# EAGLE design power supply (EAGLE 9.6.2)
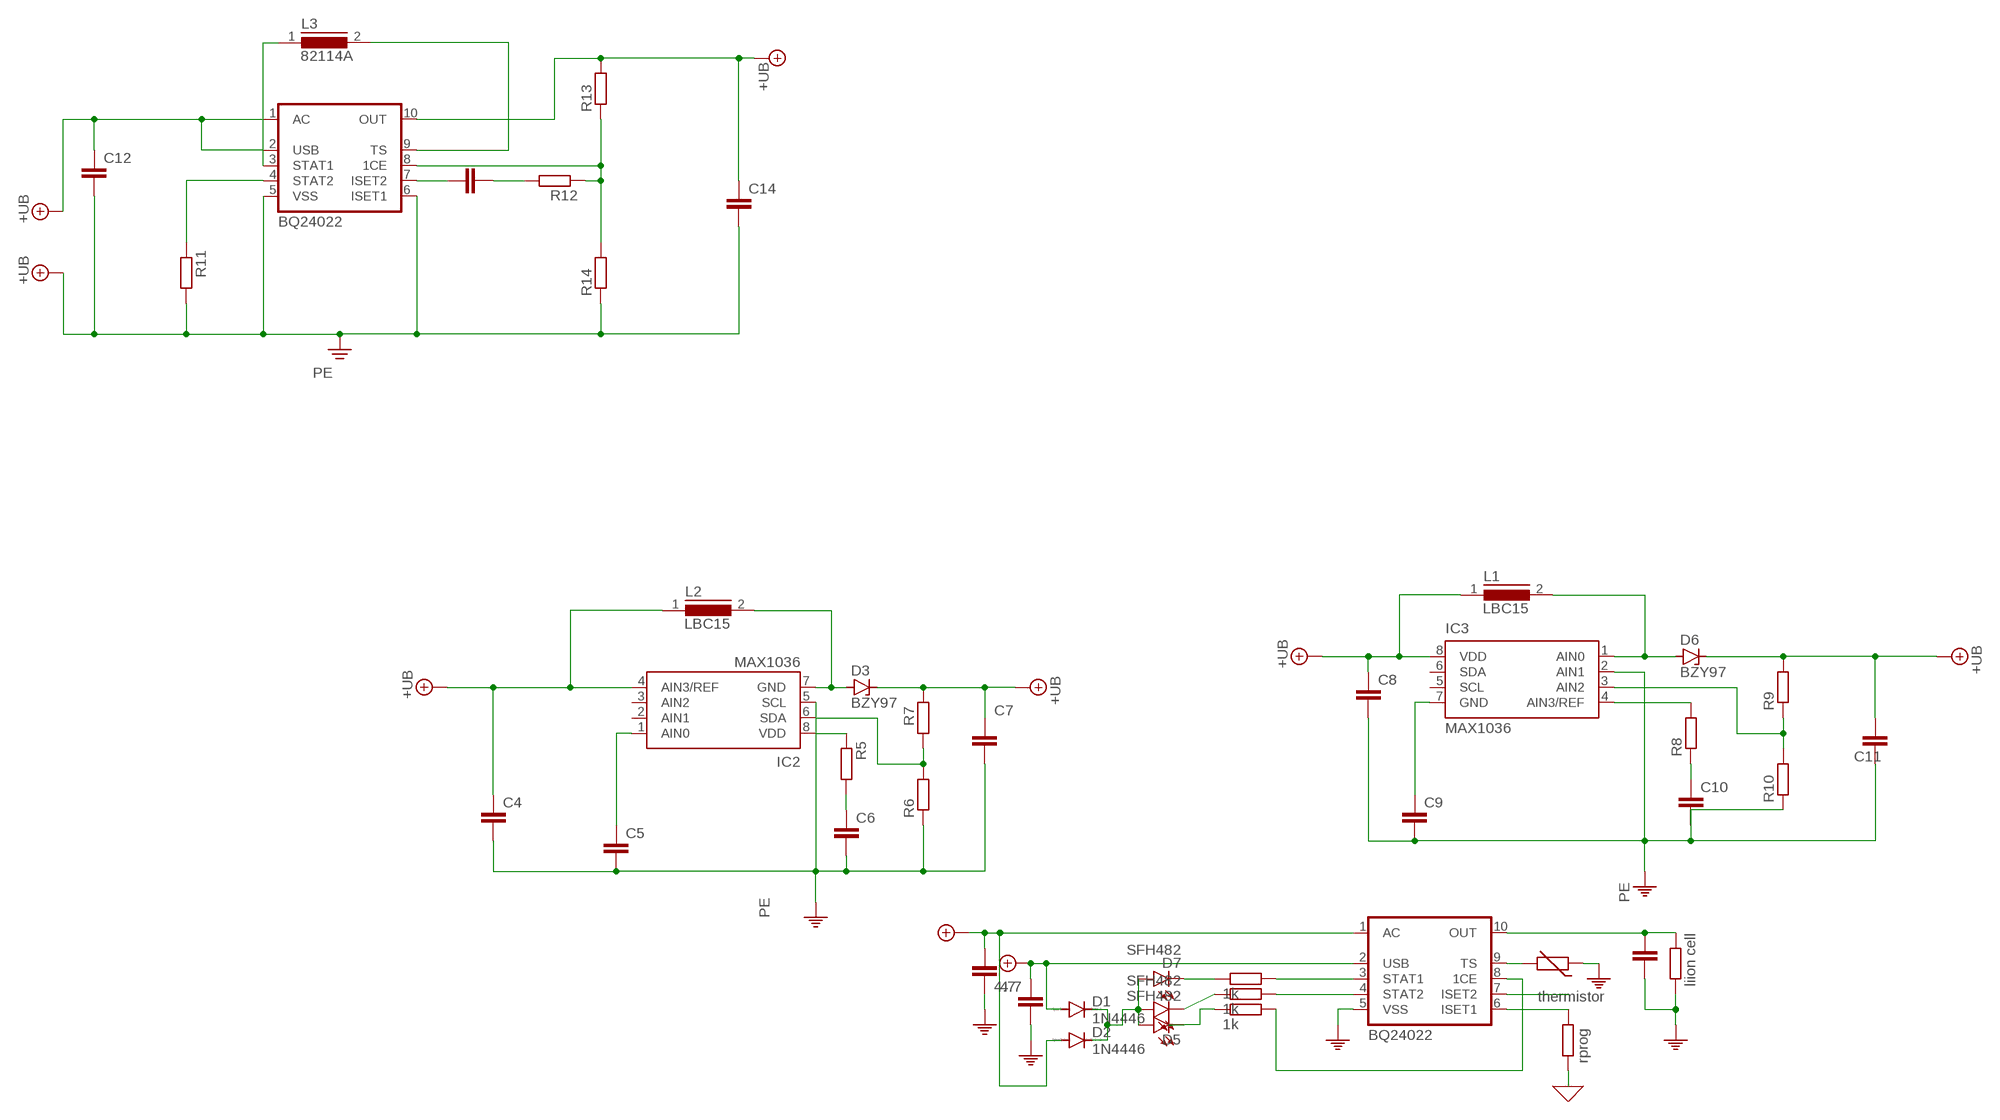
[diagram p0: schematic, sheet 1]

## Parts
C1  4.7  C2,5-3  [C2.5-3]
C2  4.7  C2,5-3  [C2.5-3]
C3  C2,5-3  [C2.5-3]
C4  C2,5-3  [C2.5-3]
C5  C2,5-3  [C2.5-3]
C6  C2,5-3  [C2.5-3]
C7  C2,5-3  [C2.5-3]
C8  C2,5-3  [C2.5-3]
C9  C2,5-3  [C2.5-3]
C10  C2,5-3  [C2.5-3]
C11  C2,5-3  [C2.5-3]
C12  C2,5-3  [C2.5-3]
C13  C2,5-3  [C2.5-3]
C14  C2,5-3  [C2.5-3]
D1  1N4446  [DO35-10]
D2  1N4446  [DO35-10]
D3  BZY97  [F126Z12]
D4  SFH482  [SFH482]
D5  SFH482  [SFH482]
D6  BZY97  [F126Z12]
D7  SFH482  [SFH482]
IC1  BQ24022  [DRC-S-PVSON-N10]
IC2  MAX1036  [SOT23-8L]
IC3  MAX1036  [SOT23-8L]
IC4  BQ24022  [DRC-S-PVSON-N10]
L1  LBC15  [LBC15]
L2  LBC15  [LBC15]
L3  82114A  [82114A]
LIIONCELL  liion cell  R-EU_0204/2V  [0204V]
R1  1k  R-EU_0204/2V  [0204V]
R2  1k  R-EU_0204/2V  [0204V]
R3  1k  R-EU_0204/2V  [0204V]
R4  rprog  R-EU_0204/2V  [0204V]
R5  R-EU_0204/2V  [0204V]
R6  R-EU_0204/2V  [0204V]
R7  R-EU_0204/2V  [0204V]
R8  R-EU_0204/2V  [0204V]
R9  R-EU_0204/2V  [0204V]
R10  R-EU_0204/2V  [0204V]
R11  R-EU_0204/2V  [0204V]
R12  R-EU_0204/2V  [0204V]
R13  R-EU_0204/2V  [0204V]
R14  R-EU_0204/2V  [0204V]
THERMISTOR  thermistor  THERMISTOR_R-5  [R-5]

## Nets
0: R4.1 ; supply symbol labelled GND
+UB: C1.1 C2.2 C4.1 C7.1 C8.1 C11.1 C12.1 C12.2 C14.1 C14.2 D1.A D2.A D3.C D6.C IC1.1(AC) IC1.2(USB) IC2.4(AIN3/REF) IC3.8(VDD) IC4.1(AC) IC4.2(USB) IC4.5(VSS) IC4.6(ISET1) IC4.10(OUT) L1.1 L2.1 R7.2 R9.2 R11.2 R13.2 R14.1 ; supply symbol labelled PE
N$1: D7.K(C) R1.1
N$2: IC1.3(STAT1) R1.2
N$3: IC1.4(STAT2) R2.2
N$4: D4.K(C) R2.1
N$5: C6.1 R5.2
N$6: D1.C D2.C
N$7: IC1.6(ISET1) R4.2
N$8: IC1.8(1CE) R3.2
N$9: IC1.7(ISET2)
N$10: IC1.9(TS) THERMISTOR.2
N$11: D5.K(C) R3.1
N$12: C3.1 IC1.10(OUT) LIIONCELL.2
N$13: D4.A D5.A D7.A
N$14: C9.1 IC3.7(GND)
N$15: D3.A IC2.7(GND) L2.2
N$16: C5.1 IC2.1(AIN0)
N$17: D6.A IC3.1(AIN0) L1.2
N$18: IC2.8(VDD) R5.1
N$19: IC2.6(SDA) R6.2 R7.1
N$20: C10.1 R8.1
N$21: IC3.4(AIN3/REF) R8.2
N$22: C13.1 IC4.7(ISET2)
N$23: C13.2 R12.2
N$24: IC3.3(AIN2) R9.1 R10.2
N$25: IC4.4(STAT2) R11.1
N$26: IC4.3(STAT1) L3.1
N$27: IC4.9(TS) L3.2
N$29: IC4.8(1CE) R12.1 R13.1 R14.2
PE: C1.2 C2.1 C3.2 C4.2 C5.2 C6.2 C7.2 C8.2 C9.2 C10.2 C11.2 IC1.5(VSS) IC2.5(SCL) IC3.2(AIN1) LIIONCELL.1 R6.1 R10.1 THERMISTOR.1
Unconnected: IC1.TH IC2.2(AIN1) IC2.3(AIN2) IC3.5(SCL) IC3.6(SDA) IC4.TH

## Library data of the parts
C1-C14 = capacitor-wima:C: CAPACITOR naming: grid - package width
D1 D2 = diode:1N4446: DIODE high speed (Philips)
D3 D6 = diode:BZY97: Z DIODE
D4 D5 D7 = led:SFH482: IR LED infrared emitting diode, Infineon
IC1 IC4 = texas:BQ24022: SINGLE-CHIP, LI-ION AND LI-POL CHARGER IC WITH AUTONOMOUS USB-PORT AND AC-ADAPTER SUPPLY MANAGEMENT (bqTINY™-II) Source: bq24022.pdf (www.ti.com)
IC2 IC3 = maxim:MAX103*: 2.7V to 5.5V, Low-Power, 4-/12-Channel 2-Wire Serial 8-Bit ADCs Source: http://datasheets.maxim-ic.com/en/ds/MAX1036-MAX1039M.pdf; MPN: MAX1036EKA+T; OC_FARNELL: 1714868; OC_NEWARK: 67K3900
L1 L2 = inductors:LBC15: INDUCTOR; SPICEPREFIX: L
L3 = inductors:82114A: INDUCTOR; SPICEPREFIX: L
LIIONCELL R1-R14 = rcl:R-EU_: RESISTOR, European symbol; SPICEPREFIX: R
THERMISTOR = discrete:THERMISTOR_: Thermo Resistor

## Board
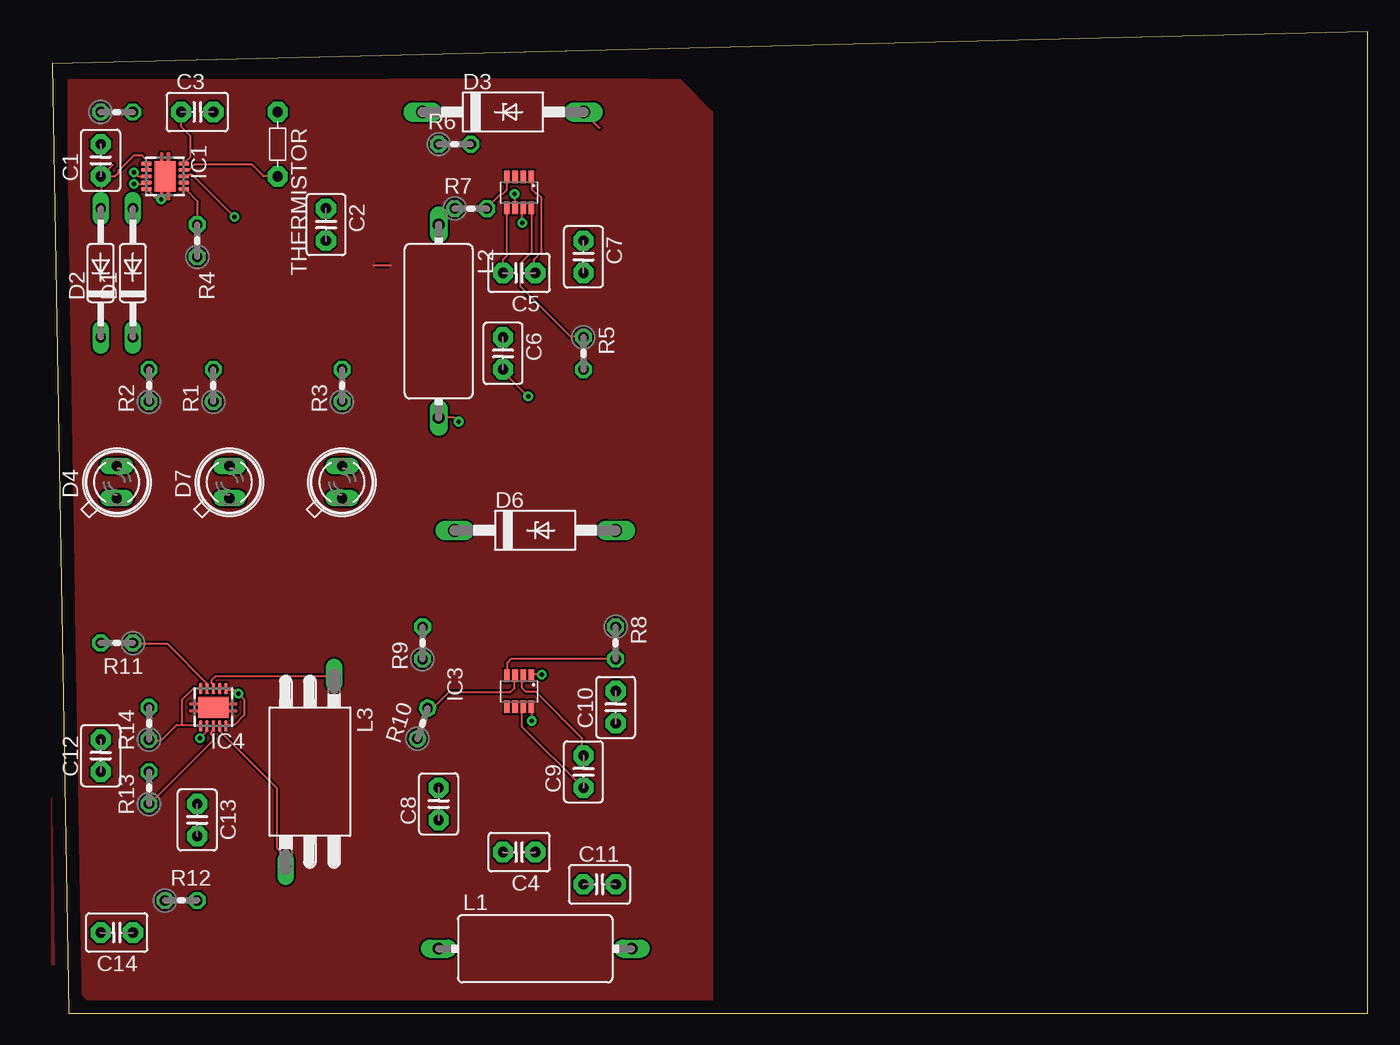
[diagram p1: board, top side]
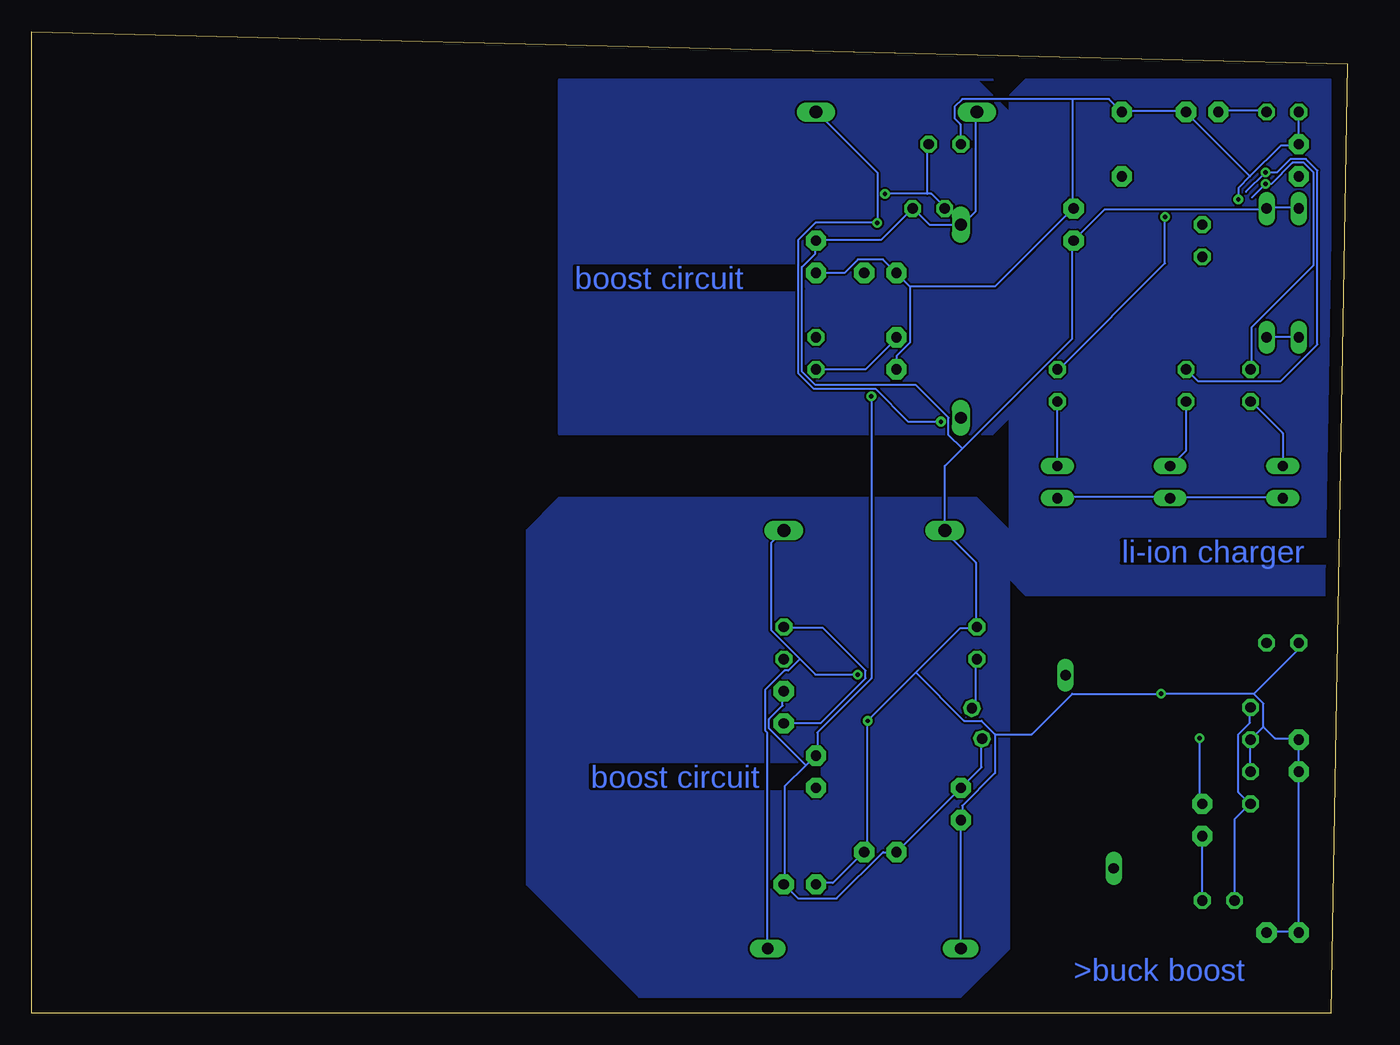
[diagram p2: board, bottom side, seen from below]

Size 103.81 x 77.46 mm. Coordinates in mm from the lower left corner, seen from the top.
Outline: 1.27,0 103.81,0 103.81,77.46 0,74.92 1.27,0
Copper layers (1*16): Top 0.035mm / dielectric 1.5mm / Bottom 0.035mm
Design rules "default": minimum track width 6mil, minimum drill 0.35mm, track to track 6mil, track to pad 6mil, pad to pad 6mil, via to via 6mil, smd to smd 6mil, copper to edge 40mil, drill to drill 6mil, minimum pad ring 10mil, minimum via ring 8mil, stop-mask expansion 4mil, vias tented up to drill 0mil, thermal gap 10mil

### Footprints (pad centres in the part's own frame; a part is rotated, then mirrored left to right if it is on the bottom)
C2.5-3 = drill 0.813 pad 1.6 octagon: 1 -1.27,0; 2 1.27,0
DO35-10 = drill 0.813 long: A 5.08,0; C -5.08,0
F126Z12 = drill 1.016 long: A 6.35,0; C -6.35,0
SFH482 = drill 0.813 long: A -1.27,0; K 1.27,0
DRC-S-PVSON-N10 = smd 0.28 x 0.85: 1 -1,-1.475; 2 -0.5,-1.475; 3 0,-1.475; 4 0.5,-1.475; 5 1,-1.475; 6 1,1.475; 7 0.5,1.475; 8 0,1.475; 9 -0.5,1.475; 10 -1,1.475 | smd 2.4 x 1.65: TH 0,0
SOT23-8L = smd 0.45 x 1: 1 -0.975,-1.225; 2 -0.325,-1.225; 3 0.325,-1.225; 4 0.975,-1.225; 5 0.975,1.225; 6 0.325,1.225; 7 -0.325,1.225; 8 -0.975,1.225
LBC15 = drill 0.914 long: 1 -7.62,0; 2 7.62,0
82114A = drill 0.813 long: 1 -7.62,1.905; 2 7.62,-1.905
0204V = drill 0.813 octagon: 1 -1.27,0; 2 1.27,0
R-5 = drill 0.813 pad 1.6 octagon: 1 -2.54,0; 2 2.54,0

### Placement (x,y rotation side)
C1  3.81,67.31 90 top
C2  21.59,62.23 270 top
C3  11.43,71.12 0 top
C4  36.83,12.7 180 top
C5  36.83,58.42 180 top
C6  35.56,52.07 270 top
C7  41.91,59.69 270 top
C8  30.48,16.51 90 top
C9  41.91,19.05 90 top
C10  44.45,24.13 90 top
C11  43.18,10.16 0 top
C12  3.81,20.32 90 top
C13  11.43,15.24 270 top
C14  5.08,6.35 180 top
D1  6.35,58.42 90 top
D2  3.81,58.42 90 top
D3  35.56,71.12 0 top
D4  5.08,41.91 90 top
D5  22.86,41.91 90 top
D6  38.1,38.1 0 top
D7  13.97,41.91 90 top
IC1  8.89,66.04 270 top
IC2  36.83,64.77 180 top
IC3  36.83,25.4 180 top
IC4  12.7,24.13 180 top
L1  38.1,5.08 0 top
L2  30.48,54.61 270 top
L3  20.32,19.05 270 top
LIIONCELL  5.08,71.12 0 top
R1  12.7,49.53 90 top
R2  7.62,49.53 90 top
R3  22.86,49.53 90 top
R4  11.43,60.96 90 top
R5  41.91,52.07 270 top
R6  31.75,68.58 0 top
R7  33.02,63.5 0 top
R8  44.45,29.21 270 top
R9  29.21,29.21 90 top
R10  29.21,22.86 71.5 top
R11  5.08,29.21 180 top
R12  10.16,8.89 0 top
R13  7.62,17.78 90 top
R14  7.62,22.86 90 top
THERMISTOR  17.78,68.58 270 top

### Tracks (layer width: path | path; a pad name or v marks a point on that pad's centre or on a via)
+UB  (via drill 0.35)
  Top 0.152: IC1.2 7.52,66.65 7.52,66.95 IC1.1 | 3.86,66.04 4.17,66.34 | 4.17,66.34 4.78,66.95 | 7.37,66.95 IC1.1 | 3.86,66.04 3.86,63.6 D2.A | 3.86,66.04 C1.1 4.17,66.34 | 6.3,63.6 D1.A 6.45,63.45 | 21.54,61.01 C2.2 | IC4.10 13.77,22.76 14.38,22.76 15.14,23.52 15.14,24.74 v14.68,25.2 14.38,25.5 13.77,25.5 IC4.1 13.61,25.65 13.31,25.65 IC4.2 | 10.26,22.76 9.8,22.76 8.59,21.54 7.67,21.54 R14.1 | 10.26,22.76 11.63,22.76 IC4.6 | 10.26,22.76 10.26,24.74 11.18,25.65 11.63,25.65 IC4.5 | IC2.4 35.87,65.89 35.87,64.97 35.56,64.67 35.41,64.67 34.34,63.6 R7.2 | 4.17,66.34 4.47,66.04 4.93,66.04 5.23,66.34 5.23,66.5 6.45,67.72 7.06,67.72 7.37,67.41 7.37,67.11 IC1.1 | v37.85,23.06 37.85,24.13 IC3.8
  Bottom 0.152: 3.86,6.45 6.3,6.45 C14.1 | 3.86,6.45 3.86,18.95 C12.1 3.86,19.1 3.86,21.54 C12.2 3.86,21.69 5.69,21.69 6.6,22.61 | 3.86,6.45 C14.2 | 7.37,25.2 v14.68,25.2 21.69,25.2 24.89,22 27.79,22 | 7.37,25.2 6.6,24.44 6.6,22.61 | 6.6,22.61 R14.1 7.67,21.54 7.67,19.1 R13.2 | 7.37,25.2 3.86,28.7 3.86,29.16 R11.2 | D3.C 29.31,71.07 29.31,63.3 30.38,62.23 L2.1 32.97,62.23 34.19,63.45 R7.2 36.78,61.01 41.81,61.01 C7.1 41.96,60.86 41.96,59.94 43.03,58.88 43.03,50.65 41.96,49.58 34.04,49.58 31.45,46.99 31.45,45.62 30.38,44.55 | D2.A 3.86,63.6 6.3,63.6 D1.A 6.45,63.45 19.1,63.45 C2.2 21.69,60.86 21.69,53.24 30.38,44.55 | L1.1 30.53,5.08 30.53,15.14 C8.1 30.38,15.29 30.38,16.36 27.79,18.95 27.79,22 | C11.1 41.81,10.26 40.59,10.26 38.15,12.7 C4.1 38,12.7 37.85,12.85 v37.85,23.06 34.04,26.87 | 34.04,26.87 30.53,30.38 29.31,30.38 R9.2 29.31,30.53 29.31,35.56 31.75,38 D6.C 31.75,43.18 30.38,44.55 | 27.79,22 28.85,23.06 30.23,23.06 34.04,26.87
N$1
  Top 0.152: 13.92,43.18 D7.K
  Bottom 0.152: R1.1 12.7,44.4 13.92,43.18 D7.K
N$2  (via drill 0.35)
  Top 0.152: IC1.3 6.76,66.04 v6.45,66.34
  Bottom 0.152: 7.98,64.82 v6.45,66.34 5.54,66.34 4.47,67.41 3.25,67.41 2.34,66.5 2.34,52.78 5.23,49.89 11.79,49.89 R1.2
N$3  (via drill 0.35)
  Top 0.152: v6.45,65.43 7.37,65.43 IC1.4
  Bottom 0.152: 7.52,64.36 v6.45,65.43 5.99,65.43 4.32,67.11 3.4,67.11 2.64,66.34 2.64,59.03 7.52,54.15 7.52,50.8 R2.2
N$4
  Top 0.152: 7.52,48.21 R2.1
  Bottom 0.152: D4.K 5.08,45.77 7.52,48.21 R2.1
N$5
  Bottom 0.152: R5.2 38,50.8 35.56,53.24 C6.1
N$6
  Top 0.152: 3.86,53.39 D2.C | 6.3,53.39 D1.C
  Bottom 0.152: D2.C 3.86,53.39 6.3,53.39 D1.C
N$7
  Top 0.152: 11.33,62.23 R4.2 11.48,62.23 11.48,64.06 10.57,64.97 10.41,64.97 IC1.6
N$8  (via drill 0.35)
  Top 0.152: 22.76,50.8 R3.2 | IC1.8 10.72,66.04 10.87,66.19 11.02,66.19 v14.38,62.84
  Bottom 0.152: v14.38,62.84 14.38,59.18 22.76,50.8 R3.2
N$10
  Top 0.152: 17.42,66.34 17.73,66.04 THERMISTOR.2 17.42,66.34 | 17.42,66.34 17.27,66.5 | 17.42,66.34 17.12,66.04 16.66,66.04 15.75,66.95 11.18,66.95 10.72,66.5 10.41,66.5 IC1.9
N$11
  Top 0.152: 22.91,43.18 D5.K | 22.91,48.21 R3.1
  Bottom 0.152: D5.K 22.91,43.18 22.91,48.21 R3.1
N$12
  Top 0.152: 10.26,67.11 IC1.10 10.41,67.11 10.87,67.56 10.87,69.24 10.11,70 10.11,71.07 C3.1 | 10.26,71.07 C3.1 | 6.45,71.22 LIIONCELL.2 | 10.11,71.22 C3.1
  Bottom 0.152: C3.1 10.11,71.22 6.45,71.22 LIIONCELL.2
N$13
  Top 0.152: 5.08,40.74 D4.A | 13.92,40.74 D7.A 14.07,40.74 | 22.76,40.74 D5.A
  Bottom 0.152: D4.A 5.08,40.74 13.92,40.74 D7.A 14.07,40.74 22.76,40.74 D5.A
N$14
  Top 0.152: C9.1 37.08,22.61 37.08,24.13 IC3.7
N$15  (via drill 0.35)
  Top 0.152: D3.A 43.18,69.85 | v37.08,62.38 37.08,63.45 IC2.7 | L2.2 31.75,46.99 v32.05,46.68
  Bottom 0.152: D3.A 41.81,71.07 37.08,66.34 v37.08,62.38 41.96,62.38 43.33,61.01 43.33,50.49 42.11,49.28 37.24,49.28 34.65,46.68 v32.05,46.68
N$16
  Top 0.152: IC2.1 37.85,65.89 37.85,64.97 38.15,64.67 38.3,64.67 38.61,64.36 38.61,60.1 38,59.49 38,58.42 C5.1
N$17  (via drill 0.35)
  Top 0.152: v38.61,26.72 37.85,26.72 IC3.1
  Bottom 0.152: v38.61,26.72 41.96,26.72 43.18,27.94 | 43.18,27.94 45.47,30.23 45.47,37.08 D6.A | 43.18,27.94 44.09,27.03 44.4,27.03 45.92,25.5 45.92,22.3 45.77,22.15 45.77,5.08 L1.2
N$18
  Top 0.152: IC2.8 37.85,63.45 37.85,60.1 36.93,59.18 36.93,57.35 40.89,53.39 41.81,53.39 R5.1
N$19  (via drill 0.35)
  Top 0.152: v36.47,64.67 36.47,63.6 IC2.6
  Bottom 0.152: 33.12,64.67 32.82,64.67 31.75,63.6 R7.1 | 33.12,64.67 v36.47,64.67 | 33.12,64.67 33.12,68.48 R6.2
N$20
  Bottom 0.152: R8.1 44.4,30.38 41.35,30.38 38,27.03 38,26.42 41.5,22.91 44.4,22.91 C10.1
N$21
  Top 0.152: R8.2 36.17,27.94 35.87,27.63 35.87,26.72 IC3.4
N$22  (via drill 0.35)
  Top 0.152: v11.63,21.69 12.24,22.3 12.24,22.61 IC4.7
  Bottom 0.152: v11.63,21.69 11.63,16.66 11.48,16.51 C13.1
N$23
  Bottom 0.152: R12.2 11.48,8.89 11.48,13.92 C13.2
N$24
  Top 0.152: IC3.3 36.47,26.57 36.47,25.65 36.17,25.35 31.29,25.35 30.07,24.13 29.62,24.13 R10.2
  Bottom 0.152: R9.1 29.31,27.94 29.31,24.28 29.46,24.13 R10.2
N$25
  Top 0.152: IC4.4 12.24,25.65 12.24,25.96 9.04,29.16 6.45,29.16 R11.1
N$26
  Top 0.152: IC4.3 12.7,25.96 12.55,26.11 12.55,26.26 12.85,26.57 22.15,26.57 L3.1
N$27
  Top 0.152: IC4.9 13.16,22.61 13.16,22.3 17.73,17.73 17.73,13.01 18.34,12.4 18.34,11.48 L3.2
N$28
  pour Top: 30.48,41.91 44.45,41.91 49.53,36.83 49.53,3.81 45.72,0 29.21,0 27.94,1.27 24.13,5.08 24.13,33.02 25.4,34.29 29.21,34.29 30.48,35.56
N$29
  Top 0.152: IC4.8 12.7,22.3 12.55,22.15 12.55,22 12.7,21.84 12.7,21.54 7.67,16.51 R13.1
  Bottom 0.152: R12.1 8.89,15.29 7.67,16.51 | 7.67,16.51 8.59,17.42 8.59,22 7.67,22.91 7.67,24.13 R14.2 | 7.67,16.51 R13.1
N$30
  pour Top: 2.54,34.29 22.86,34.29 24.13,33.02 24.13,3.81 0,3.81 0,30.48
N$31
  pour Top: 1.27,73.66 49.53,73.66 52.07,71.12 52.07,0 3.81,0 2.54,1.27 1.27,2.54
ONE
  pour Bottom: 1.27,73.66 25.4,73.66 26.67,72.39 26.67,34.29 25.4,33.02 1.27,33.02
PE  (via drill 0.35)
  Top 0.152: v8.59,64.21 8.28,64.21 7.52,64.97 IC1.5 | 3.86,71.07 LIIONCELL.1 | 3.86,68.63 C1.2 | 12.7,71.22 C3.2 | 17.73,71.22 THERMISTOR.1 17.88,71.07 | 21.54,63.6 C2.1 | IC3.2 37.08,26.57 37.08,25.65 37.39,25.35 38.15,25.35 41.81,21.69 41.81,20.32 C9.2 | C5.2 35.56,59.49 35.87,59.79 35.87,63.45 IC2.5 | v37.54,48.67 35.56,50.65 C6.2
  Bottom 0.152: v8.59,64.21 8.59,65.13 7.67,66.04 | R10.1 28.85,21.54 28.85,19.41 C8.2 C4.2 36.63,12.7 40.28,9.04 43.33,9.04 C11.2 44.4,10.26 44.4,17.88 42.72,19.56 | 42.72,19.56 41.96,20.32 C9.2 41.81,20.32 41.81,22.15 37.54,26.42 v37.54,48.67 | 42.72,19.56 45.62,22.45 45.62,23.22 44.55,24.28 44.55,25.35 C10.2 | C6.2 35.56,51.87 34.49,52.93 34.49,57.35 | 34.49,57.35 C5.2 36.63,59.49 38.61,59.49 39.68,58.42 C7.2 | 7.67,66.04 5.23,68.48 3.86,68.48 C1.2 3.86,68.63 3.86,71.07 LIIONCELL.1 | 7.67,66.04 12.7,71.07 C3.2 12.7,71.22 17.73,71.22 THERMISTOR.1 18.8,72.14 21.69,72.14 | 21.69,72.14 30.38,72.14 30.99,71.53 30.99,70.61 30.53,70.16 30.53,68.63 R6.1 | 21.69,72.14 21.69,63.6 C2.1 21.69,63.45 27.79,57.35 34.49,57.35
POWER
  Top 0.152: 25.35,59.03 26.72,59.03
  pour Top: 25.4,72.39 25.4,36.83 1.27,36.83 1.27,72.39 3.81,72.39
  pour Top: 26.67,73.66 26.67,44.45 46.99,44.45 46.99,73.66
S$1
  pour Bottom: 29.21,40.64 62.23,40.64 64.77,38.1 64.77,10.16 55.88,1.27 30.48,1.27 26.67,5.08 26.67,31.75 26.67,38.1
TWO
  pour Bottom: 27.94,73.66 62.23,73.66 62.23,45.72 27.94,45.72 26.67,46.99 26.67,71.12 29.21,73.66

### Text on the board
Bottom: boost circuit | li-ion charger | boost circuit | >buck boost